# EAGLE design FPV-Auto (EAGLE 7.7.0)

## Sheet 1 of 2
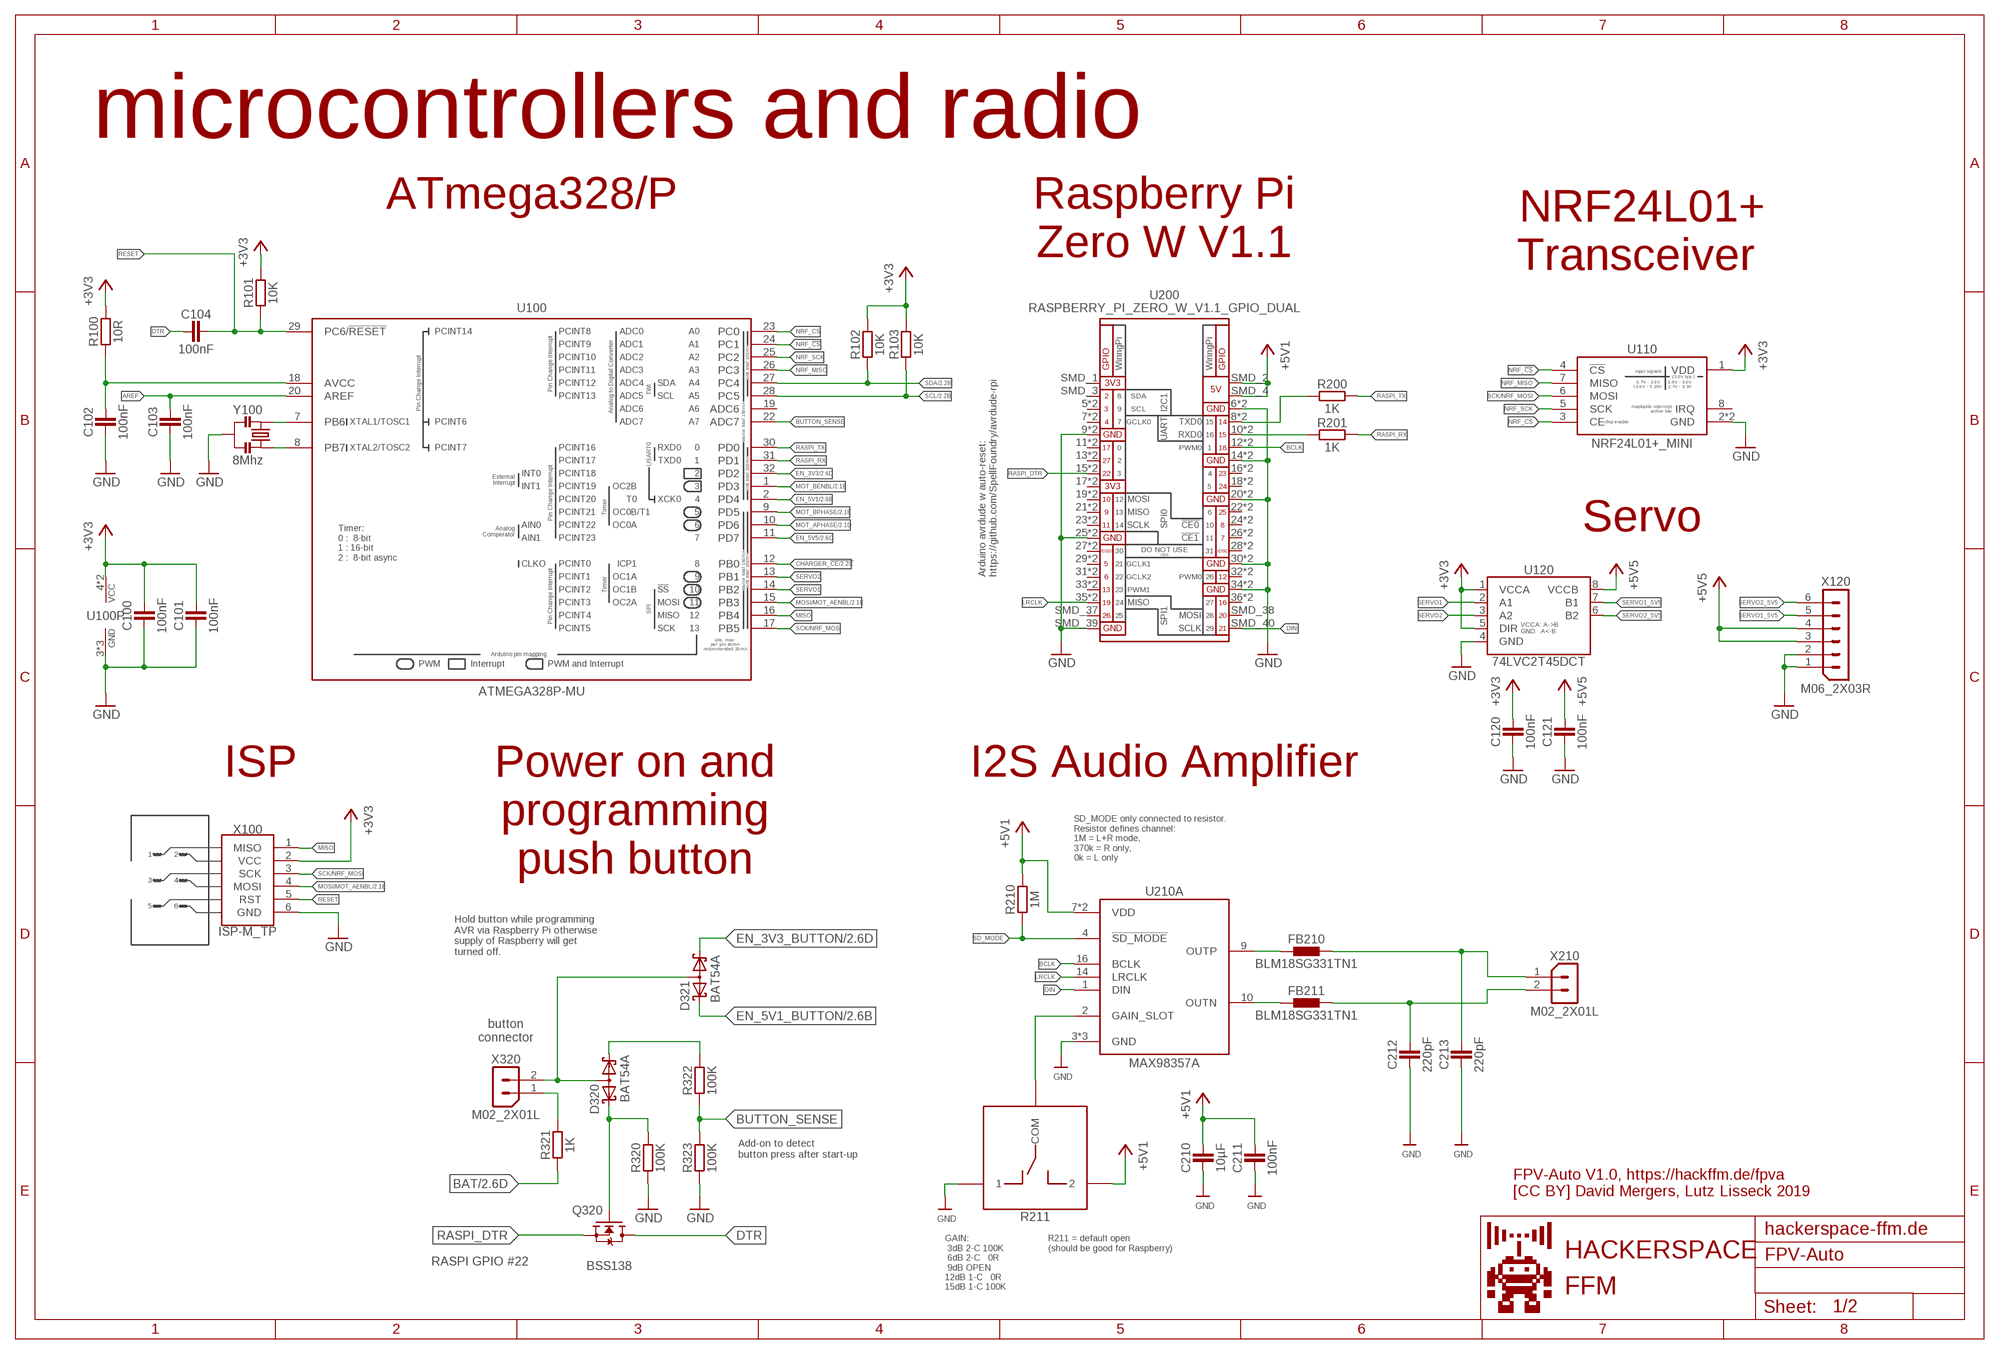
[diagram p0: schematic, sheet 1]

### Parts
C100  100nF  C0603  [C0603]
C101  100nF  C0603  [C0603]
C102  100nF  C0603  [C0603]
C103  100nF  C0603  [C0603]
C104  100nF  C0603  [C0603]
C120  100nF  C0603  [C0603]
C121  100nF  C0603  [C0603]
C210  10µF  C0603  [C0603]
C211  100nF  C0603  [C0603]
C212  220pF  C0603  [C0603]
C213  220pF  C0603  [C0603]
D320  BAT54A  [SOT23]
D321  BAT54A  [SOT23]
FB210  BLM18SG331TN1  [0603]
FB211  BLM18SG331TN1  [0603]
Q320  BSS138  [SOT23-3]
R100  10R  R  [R0603]
R101  10K  R  [R0603]
R102  10K  R  [R0603]
R103  10K  R  [R0603]
R200  1K  R  [R0603]
R201  1K  R  [R0603]
R210  1M  R  [R0603]
R211  R_SWITCH_2_WAY_0603  [R0603_SWITCH_2_WAY]
R320  100K  R  [R0603]
R321  1K  R  [R0603]
R322  100K  R  [R0603]
R323  100K  R  [R0603]
U100  ATMEGA328P-MU  [PBS(S-PQFP-G32)]
U110  NRF24L01+_MINI  [NRF24L01+_MINI]
U120  74LVC2T45DCT  [DCT(R-PDSO-G8)]
U200  RASPBERRY_PI_ZERO_W_V1.1_GPIO_DUAL  [RASPBERRY_PI_ZERO_W_V1.1_GPIO_DUAL]
U210  MAX98357A  [90-0031]
X100  ISP-M_TP  [ISP-M_TP]
X120  M06_2X03R  [M2X03R]
X210  M02_2X01L  [M2X01L]
X320  M02_2X01L  [M2X01L]
Y100  8Mhz  CSTNE8M00GH5C000R0  [CSTNE]

### Nets
+3V3: C100.1 C101.1 C120.1 R100.2 R101.2 R102.2 R103.2 U100.4(VCC) U100.6(VCC) U110.1(VDD) U120.1(VCCA) U120.5(DIR) X100.2(VCC) ; also sheet 2
+5V1: C210.1 C211.1 R210.2 R211.2 U200.SMD_2(5V) U200.SMD_4(5V) U210.7(A:VDD) U210.8(A:VDD) ; also sheet 2
+5V5: C121.1 U120.8(VCCB) X120.3 X120.4 ; also sheet 2
AREF: C103.1 U100.20(AREF)
BAT: R321.2 ; also sheet 2
BCLK: U200.12(GPIO18) U200.SMD_12(GPIO18) U210.16(A:BCLK)
BUTTON_SENSE: R322.1 R323.2 U100.22(ADC7)
CHARGER_!CE: U100.12(PB0) ; also sheet 2
DIN: U200.SMD_40(GPIO21) U210.1(A:DIN)
DTR: C104.2 Q320.3(D)
EN_3V3: U100.32(PD2) ; also sheet 2
EN_3V3_BUTTON: D321.1(K1) ; also sheet 2
EN_5V1: U100.2(PD4) ; also sheet 2
EN_5V1_BUTTON: D321.2(K2) ; also sheet 2
EN_5V5: U100.11(PD7) ; also sheet 2
GAIN: R211.COM U210.2(A:GAIN_SLOT)
GND: C100.2 C101.2 C102.2 C103.2 C120.2 C121.2 C210.2 C211.2 C212.2 C213.2 R211.1 R320.1 R323.1 U100.3(GND) U100.5(GND) U100.21(GND) U110.2(GND) U110.9(GND) U120.4(GND) U200.6(GND) U200.9(GND) U200.14(GND) U200.20(GND) U200.25(GND) U200.30(GND) U200.34(GND) U200.SMD_6(GND) U200.SMD_9(GND) U200.SMD_14(GND) U200.SMD_20(GND) U200.SMD_25(GND) U200.SMD_30(GND) U200.SMD_34(GND) U200.SMD_39(GND) U210.3(A:GND) U210.11(A:GND) U210.15(A:GND) X100.6(GND) X120.1 X120.2 Y100.2 ; also sheet 2
LRCLK: U200.35(GPIO19) U200.SMD_35(GPIO19) U210.14(A:LRCLK)
MISO: U100.16(PB4) X100.1(MISO)
MOSI/MOT_AENBL: U100.15(PB3) X100.4(MOSI) ; also sheet 2
MOT_APHASE: U100.10(PD6) ; also sheet 2
MOT_BENBL: U100.1(PD3) ; also sheet 2
MOT_BPHASE: U100.9(PD5) ; also sheet 2
N$2: D320.3(AA) D321.3(AA) X320.2
N$6: FB211.1 U210.10(A:OUTN)
N$7: FB210.1 U210.9(A:OUTP)
N$8: U100.8(PB7) Y100.3
N$9: U100.7(PB6) Y100.1
N$15: D320.2(K2) R322.2
N$18: D320.1(K1) Q320.1(G) R320.2
N$22: R321.1 X320.1
N$25: C102.1 R100.1 U100.18(AVCC)
N$26: R200.1 U200.8(GPIO14/TXD0) U200.SMD_8(GPIO14/TXD0)
N$27: R201.1 U200.10(GPIO15/RXD0) U200.SMD_10(GPIO15/RXD0)
NRF_!CS: U100.24(PC1) U110.4(!CS)
NRF_CS: U100.23(PC0) U110.3(CE)
NRF_MISO: U100.26(PC3) U110.7(MISO)
NRF_SCK: U100.25(PC2) U110.5(SCK)
RASPI_DTR: Q320.2(S) U200.15(GPIO22/GEN3) U200.SMD_15(GPIO22/GEN3)
RASPI_RX: R201.2 U100.31(PD1)
RASPI_TX: R200.2 U100.30(PD0)
RESET: C104.1 R101.1 U100.29(PC6/!RESET!) X100.5(RST)
SCK/NRF_MOSI: U100.17(PB5) U110.6(MOSI) X100.3(SCK)
SCL: R103.1 U100.28(PC5) ; also sheet 2
SD_MODE: R210.1 U210.4(A:!SD_MODE)
SDA: R102.1 U100.27(PC4) ; also sheet 2
SERVO1: U100.14(PB2) U120.2(A1)
SERVO1_5V5: U120.7(B1) X120.5
SERVO2: U100.13(PB1) U120.3(A2)
SERVO2_5V5: U120.6(B2) X120.6
VO+: C213.1 FB210.2 X210.1
VO-: C212.1 FB211.2 X210.2
Unconnected: U100.19(ADC6) U110.8(IRQ) U200.5(GPIO3/SCL1) U200.7(GPIO4/GCKL) U200.11(GPIO17/GEN0) U200.13(GPIO27/GEN2) U200.16(GPIO23/GEN4) U200.17(3V3) U200.18(GPIO24/GEN5) U200.19(GPIO10/MOSI) U200.21(GPIO9/MISO) U200.22(GPIO25/GEN6) U200.23(GPIO11/SCLK) U200.24(GPIO8/!CE0!) U200.26(GPIO7/!CE1!) U200.27(ID_SD) U200.28(ID_SC) U200.29(GPIO5) U200.31(GPIO6) U200.32(GPIO12) U200.33(GPIO13) U200.36(GPIO16) U200.SMD_1(3V3) U200.SMD_3(GPIO2/SDA1) U200.SMD_5(GPIO3/SCL1) U200.SMD_7(GPIO4/GCKL) U200.SMD_11(GPIO17/GEN0) U200.SMD_13(GPIO27/GEN2) U200.SMD_16(GPIO23/GEN4) U200.SMD_17(3V3) U200.SMD_18(GPIO24/GEN5) U200.SMD_19(GPIO10/MOSI) U200.SMD_21(GPIO9/MISO) U200.SMD_22(GPIO25/GEN6) U200.SMD_23(GPIO11/SCLK) U200.SMD_24(GPIO8/!CE0!) U200.SMD_26(GPIO7/!CE1!) U200.SMD_27(ID_SD) U200.SMD_28(ID_SC) U200.SMD_29(GPIO5) U200.SMD_31(GPIO6) U200.SMD_32(GPIO12) U200.SMD_33(GPIO13) U200.SMD_36(GPIO16) U200.SMD_37(GPIO26) U200.SMD_38(GPIO20)

### Notes on the sheet
- microcontrollers and radio
- ATmega328/P
- Raspberry Pi
  Zero W V1.1
- NRF24L01+
  Transceiver
- Servo
- Arduino avrdude w auto-reset:
  https://github.com/SpellFoundry/avrdude-rpi
- ISP
- Power on and
  programming
  push button
- I2S Audio Amplifier
- SD_MODE only connected to resistor. 
  Resistor defines channel: 
  1M = L+R mode, 
  370k = R only, 
  0k = L only
- Hold button while programming
  AVR via Raspberry Pi otherwise
  supply of Raspberry will get
  turned off.
- button
  connector
- Add-on to detect 
  button press after start-up
- FPV-Auto V1.0, https://hackffm.de/fpva
  [CC BY] David Mergers, Lutz Lisseck 2019
- GAIN:
   3dB 2-C 100K
   6dB 2-C   0R
   9dB OPEN
  12dB 1-C   0R
  15dB 1-C 100K
- R211 = default open 
  (should be good for Raspberry)
- RASPI GPIO #22

## Sheet 2 of 2
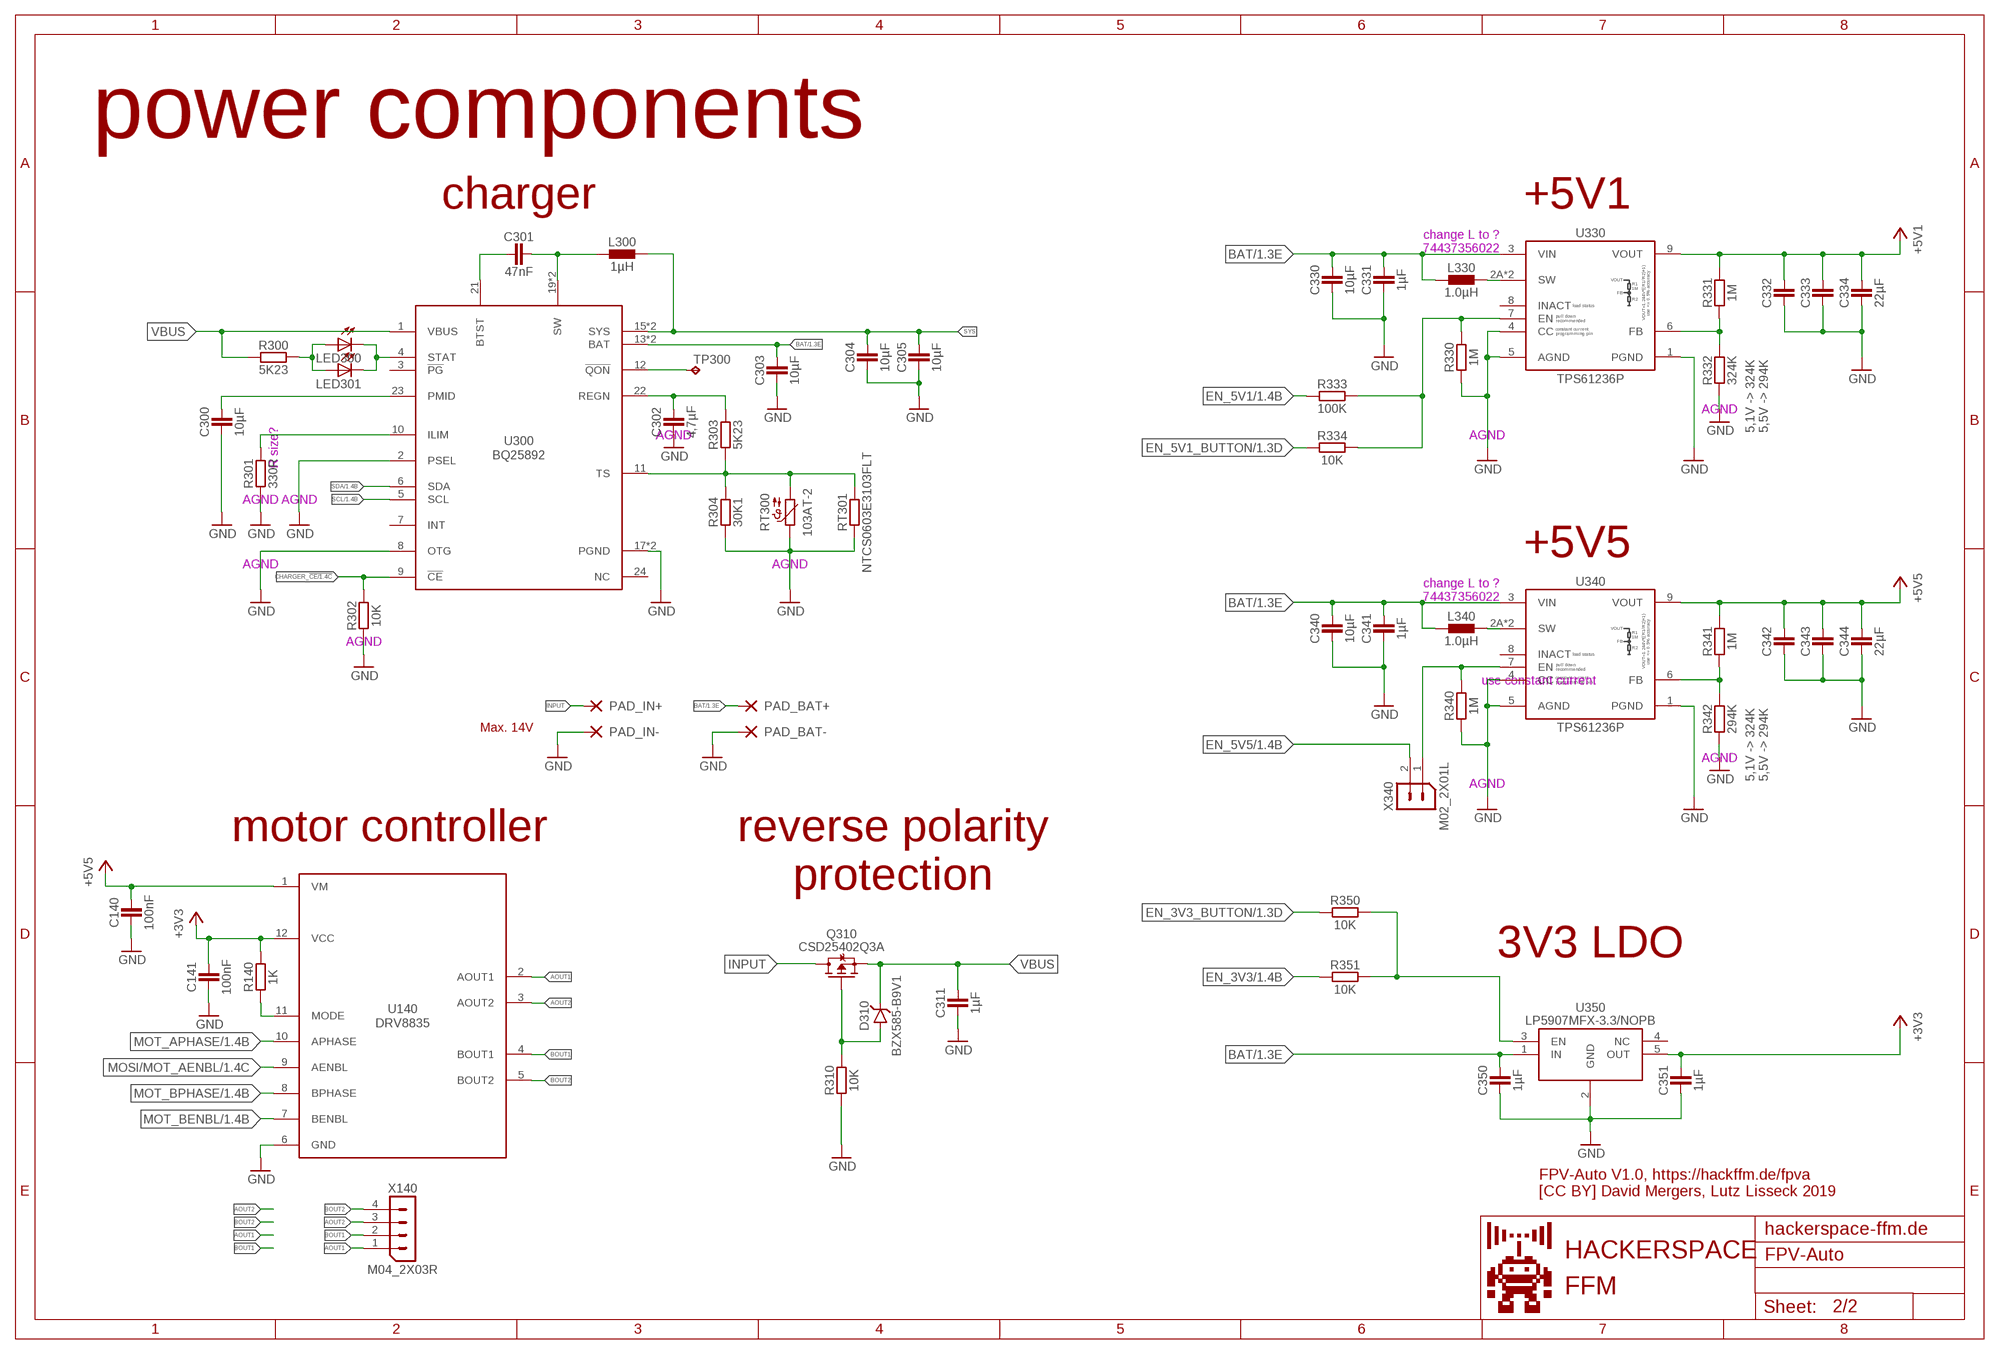
[diagram p1: schematic, sheet 2]

### Parts
C140  100nF  C0603  [C0603]
C141  100nF  C0603  [C0603]
C300  10µF  C0805  [C0805]
C301  47nF  C0402  [C0402]
C302  4,7µF  C0603  [C0603]
C303  10µF  C0805  [C0805]
C304  10µF  C0805  [C0805]
C305  10µF  C0805  [C0805]
C311  1µF  C0805  [C0805]
C330  10µF  C0603  [C0603]
C331  1µF  C0603  [C0603]
C332  22µF  C0805  [C0805]
C333  22µF  C0805  [C0805]
C334  22µF  C0805  [C0805]
C340  10µF  C0603  [C0603]
C341  1µF  C0603  [C0603]
C342  22µF  C0805  [C0805]
C343  22µF  C0805  [C0805]
C344  22µF  C0805  [C0805]
C350  1µF  C0603  [C0603]
C351  1µF  C0603  [C0603]
D310  BZX585-B9V1  [SOD523(SC-79)]
L300  1µH  78438357010  [4030]
L330  1.0µH  XAL7030-102ME  [XAL7030]
L340  1.0µH  XAL7030-102ME  [XAL7030]
LED300  LEDCHIP-LED0603  [CHIP-LED0603]
LED301  LED3MM  [LED3MM]
PAD_BAT+  WIREPAD2,15/1,0  [2,15/1,0]
PAD_BAT-  WIREPAD2,15/1,0  [2,15/1,0]
PAD_IN+  WIREPAD2,15/1,0  [2,15/1,0]
PAD_IN-  WIREPAD2,15/1,0  [2,15/1,0]
Q310  CSD25402Q3A  [Q3A]
R140  1K  R  [R0603]
R300  5K23  R  [R0603]
R301  330R  R  [R0603]
R302  10K  R  [R0603]
R303  5K23  R  [R0603]
R304  30K1  R  [R0603]
R310  10K  R  [R0603]
R330  1M  R  [R0603]
R331  1M  R  [R0603]
R332  324K  R  [R0603]
R333  100K  R  [R0603]
R334  10K  R  [R0603]
R340  1M  R  [R0603]
R341  1M  R  [R0603]
R342  294K  R  [R0603]
R350  10K  R  [R0603]
R351  10K  R  [R0603]
RT300  103AT-2  [AT-2]
RT301  NTCS0603E3103FLT  R  [R0603]
TP300  TPB1,27  [B1,27]
U140  DRV8835  [DSS(WSON-12)]
U300  BQ25892  [RTW(S-PWQFN-N24)_LONG]
U330  TPS61236P  [RWL(S-PQFP-N9)_LONG]
U340  TPS61236P  [RWL(S-PQFP-N9)_LONG]
U350  LP5907MFX-3.3/NOPB  [DBV(R-PDSO-G5)]
X140  M04_2X03R  [M2X02R]
X340  M02_2X01L  [M2X01L]

### Nets
+3V3: C141.1 C351.1 R140.1 U140.12(VCC) U350.5(OUT) ; also sheet 1
+5V1: C332.1 C333.1 C334.1 R331.2 U330.9(VOUT) ; also sheet 1
+5V5: C140.1 C342.1 C343.1 C344.1 R341.2 U140.1(VM) U340.9(VOUT) ; also sheet 1
AOUT1: U140.2(AOUT1) X140.1
AOUT2: U140.3(AOUT2) X140.3
BAT: C303.1 C330.1 C331.1 C340.1 C341.1 C350.1 L330.1 L340.1 PAD_BAT+.1(P) U300.13(BAT) U300.14(BAT) U330.3(VIN) U340.3(VIN) U350.1(IN) ; also sheet 1
BOUT1: U140.4(BOUT1) X140.2
BOUT2: U140.5(BOUT2) X140.4
CHARGER_!CE: R302.2 U300.9(!CE) ; also sheet 1
EN_3V3: R351.1 ; also sheet 1
EN_3V3_BUTTON: R350.1 ; also sheet 1
EN_3V3_JMP: R350.2 R351.2 U350.3(EN)
EN_5V1: R333.1 ; also sheet 1
EN_5V1_BUTTON: R334.1 ; also sheet 1
EN_5V1_JMP: R330.2 R333.2 R334.2 U330.7(EN)
EN_5V5: X340.2 ; also sheet 1
EN_5V5_JMP: R340.2 U340.7(EN) X340.1
GND: C140.2 C141.2 C300.2 C302.2 C303.2 C304.2 C305.2 C311.2 C330.2 C331.2 C332.2 C333.2 C334.2 C340.2 C341.2 C342.2 C343.2 C344.2 C350.2 C351.2 PAD_BAT-.1(P) PAD_IN-.1(P) R301.1 R302.1 R304.1 R310.1 R330.1 R332.1 R340.1 R342.1 RT300.P$1 RT301.1 U140.6(GND) U300.2(PSEL) U300.8(OTG) U300.17(PGND) U300.18(PGND) U330.1(PGND) U330.4(CC) U330.5(AGND) U340.1(PGND) U340.4(CC) U340.5(AGND) U350.2(GND) ; also sheet 1
INPUT: PAD_IN+.1(P) Q310.1(D) Q310.2(D) Q310.3(D)
MOSI/MOT_AENBL: U140.9(AENBL) ; also sheet 1
MOT_APHASE: U140.10(APHASE) ; also sheet 1
MOT_BENBL: U140.7(BENBL) ; also sheet 1
MOT_BPHASE: U140.8(BPHASE) ; also sheet 1
N$1: L330.2 U330.2A(SW) U330.2B(SW)
N$3: L340.2 U340.2A(SW) U340.2B(SW)
N$4: R341.1 R342.2 U340.6(FB)
N$5: R331.1 R332.2 U330.6(FB)
N$10: TP300.TP U300.12(!QON)
N$11: R303.1 R304.2 RT300.P$2 RT301.2 U300.11(TS)
N$12: C302.1 R303.2 U300.22(REGN)
N$13: R301.2 U300.10(ILIM)
N$14: C301.2 U300.21(BTST)
N$15_SW: C301.1 L300.P$1 U300.19(SW) U300.20(SW)
N$16: D310.A Q310.4(G) R310.2
N$17: C300.1 U300.23(PMID)
N$19: LED300.C LED301.K(C) U300.4(STAT)
N$20: LED300.A LED301.A R300.1
N$24: R140.2 U140.11(MODE)
SCL: U300.5(SCL) ; also sheet 1
SDA: U300.6(SDA) ; also sheet 1
SYS: C304.1 C305.1 L300.P$2 U300.15(SYS) U300.16(SYS)
VBUS: C311.1 D310.C Q310.TP0(S) Q310.TP1(S) Q310.TP2(S) Q310.TP3(S) Q310.TP4(S) Q310.TP5(S) Q310.TP6(S) Q310.TP7(S) R300.2 U300.1(VBUS)
Unconnected: U300.3(!PG) U300.7(INT) U300.24(NC) U330.8(INACT) U340.8(INACT) U350.4(NC)

### Notes on the sheet
- power components
- charger | +5V1
- change L to ?
  74437356022
- 5,1V -> 324K
  5,5V -> 294K
- AGND
- AGND | AGND
- R size?
- AGND | AGND
- +5V5
- AGND | AGND
- change L to ?
  74437356022
- AGND
- use constant current
- Max. 14V
- 5,1V -> 324K
  5,5V -> 294K
- AGND
- AGND
- motor controller
- reverse polarity
  protection
- 3V3 LDO
- FPV-Auto V1.0, https://hackffm.de/fpva
  [CC BY] David Mergers, Lutz Lisseck 2019

## Power pins joined to a net without a drawn wire
GND: U140.TP1(GND) U140.TP2(GND) U140.TP3(GND) U140.TP(GND) U210.TP0(T:GND) U210.TP1(T:GND) U300.TP0(GND) U300.TP1(GND) U300.TP2(GND) U300.TP3(GND) U300.TP4(GND) U300.TP5(GND) U300.TP6(GND) U300.TP7(GND) U300.TP8(GND) U300.TP9(GND)

## Library data of the parts
C100-C104 C120 C121 C140 C141 C210-C213 C300-C305 C311 C330-C334 C340-C344 C350 C351 = FPV-Auto:C
D310 = FPV-Auto:BZX585: BZX585-XXX Voltage regulator diodes Low-power voltage regulator diodes encapsulated in an ultra small SOD523 plastic SMD package. The diodes are available in the normalized E24 +- 2 pct (BZX585-B) and +- 5 pct (BZX585-C) tolerance range. The series consists of 37 types with nominal working voltages from 2.4 V to 75 V. Links Datasheet <https://assets.nexperia.com/documents/data-sheet/BZX585_SERIES.pdf> Product website <https://www.nexperia.com/products/diodes/zener-diodes/BZX585-C5V1.html>; CODE: E5; WORK_V_MAX: 9.28; WORK_V_MIN: 8.92
D320 D321 = diode:BAT54A: Schottky Diodes Source: Fairchild .. BAT54.pdf
FB210 FB211 = FPV-Auto:BLM18S: BLM18S Power Lines Type Chip Ferrite Bead Links Datasheet <https://www.murata.com/~/media/webrenewal/support/library/catalog/products/emc/emifil/c31e.ashx?la=en-gb> Product website <https://www.murata.com/en-eu/products/emc/emifil/bl>; I: 1.5; R100MHZ: 330; RDC: 0.070
L300 = FPV-Auto:78438357010: 78438357010 WE-MAIA SMT Speicherdrossel Links Datasheet <http://katalog.we-online.de/pbs/datasheet/78438321010.pdf> Product website <http://katalog.we-online.de/de/pbs/WE-MAIA/78438323082>
L330 L340 = FPV-Auto:XAL7030: XAL7030 XAL7030 Series High Current Shielded Power Inductors Links Datasheet <https://www.coilcraft.com/pdfs/xal7030.pdf> Product website <https://www.coilcraft.com/xal7030.cfm>; OC_MOUSER: 994-XAL7030-102ME; TOL: 20%
LED300 LED301 = led:LED: LED OSRAM: - CHIPLED LG R971, LG N971, LY N971, LG Q971, LY Q971, LO R971, LY R971 LH N974, LH R974 LS Q976, LO Q976, LY Q976 LO Q996 - Hyper CHIPLED LW Q18S LB Q993, LB Q99A, LB R99A - SideLED LS A670, LO A670, LY A670, LG A670, LP A670 LB A673, LV A673, LT A673, LW A673 LH A674 LY A675 LS A676, LA A676, LO A676, LY A676, LW A676 LS A679, LY A679, LG A679 - Hyper Micro SIDELED® LS Y876, LA Y876, LO Y876, LY Y876 LT Y87S - SmartLED LW L88C, LW L88S LB L89C, LB L89S, LG L890 LS L89K, LO L89K, LY L89K LS L896, LA L896, LO L896, LY L896 - TOPLED LS T670, LO T670, LY T670, LG T670, LP T670 LSG T670, LSP T670, LSY T670, LOP T670, LYG T670 LG T671, LOG T671, LSG T671 LB T673, LV T673, LT T673, LW T673 LH T674 LS T676, LA T676, LO T676, LY T676, LB T676, LH T676, LSB T676, LW T676 LB T67C, LV T67C, LT T67C, LS T67K, LO T67K, LY T67K, LW E67C LS E67B, LA E67B, LO E67B, LY E67B, LB E67C, LV E67C, LT E67C LW T67C LS T679, LY T679, LG T679 LS T770, LO T770, LY T770, LG T770, LP T770 LB T773, LV T773, LT T773, LW T773 LH T774 LS E675, LA E675, LY E675, LS T675 LS T776, LA T776, LO T776, LY T776, LB T776 LHGB T686 LT T68C, LB T68C - Hyper Mini TOPLED® LB M676 - Mini TOPLED Santana® LG M470 LS M47K, LO M47K, LY M47K Source: http://www.osram.convergy.de LUXEON: - LUMILED® LXK2-PW12-R00, LXK2-PW12-S00, LXK2-PW14-U00, LXK2-PW14-V00 LXK2-PM12-R00, LXK2-PM12-S00, LXK2-PM14-U00 LXK2-PE12-Q00, LXK2-PE12-R00, LXK2-PE12-S00, LXK2-PE14-T00, LXK2-PE14-U00 LXK2-PB12-K00, LXK2-PB12-L00, LXK2-PB12-M00, LXK2-PB14-N00, LXK2-PB14-P00, LXK2-PB14-Q00 LXK2-PR12-L00, LXK2-PR12-M00, LXK2-PR14-Q00, LXK2-PR14-R00 LXK2-PD12-Q00, LXK2-PD12-R00, LXK2-PD12-S00 LXK2-PH12-R00, LXK2-PH12-S00 LXK2-PL12-P00, LXK2-PL12-Q00, LXK2-PL12-R00 Source: www.luxeon.com KINGBRIGHT: KA-3528ASYC Source: www.kingbright.com
PAD_BAT+ PAD_BAT- PAD_IN+ PAD_IN- = wirepad:WIREPAD: Wire PAD connect wire on PCB
Q310 = FPV-Auto:CSD25402Q3A: CSD25402Q3A P-Channel NexFET Power MOSFET Links Datasheet <http://www.ti.com/lit/gpn/csd25402q3a> Product website <http://www.ti.com/product/CSD25402Q3A>
Q320 = FPV-Auto:BSS138: BSS138 N-Channel Logic Level Enhancement Mode Field Effect Transistor, 50V, 220mA Links Datasheet <https://www.onsemi.com/pub/Collateral/BSS138-D.PDF> Product website <https://www.onsemi.com/PowerSolutions/product.do?id=BSS138>
R100-R103 R140 R200 R201 R210 R300-R304 R310 R320-R323 R330-R334 R340-R342 R350 R351 RT301 = FPV-Auto:R
R211 = FPV-Auto:R_SWITCH_2_WAY
RT300 = FPV-Auto:103AT-2: AT-2 AT Thermistor Series (high accuracy type) Links Datasheet <http://www.atcsemitec.co.uk/pdfdocs/AT-2-thermistors.pdf> Product website <http://www.atcsemitec.co.uk/at-thermistors.html>
TP300 = testpad:TP: Test pad
U100 = FPV-Auto:ATMEGA328P: ATmega328P 8-Bit Mikrocontroller - MCU 32KB In-system Flash 20MHz 1.8V-5.5V Links Datasheet <http://ww1.microchip.com/downloads/en/DeviceDoc/ATmega48A-PA-88A-PA-168A-PA-328-P-DS-DS40002061A.pdf> Product website <https://www.microchip.com/wwwproducts/en/ATmega328p>; OC_MOUSER: 556-ATMEGA328P-AU
U110 = FPV-Auto:NRF24L01+: nRF24L01+ Single Chip 2.4GHz Transceiver Links Datasheet <https://www.nordicsemi.com/eng/nordic/download_resource/8765/2/78942384/2726> Product website <https://www.nordicsemi.com/eng/Products/2.4GHz-RF/nRF24L01P/(language)/eng-GB>
U120 = FPV-Auto:74*2T45: SN74LVC2T45 ual-Bit Dual-Supply Bus Transceiver With Configurable Voltage Translation Links Datasheet <http://www.ti.com/lit/gpn/sn74lvc2t45> Product website <http://www.ti.com/product/SN74LVC2T45>
U140 = FPV-Auto:DRV8835: DRV8835 DRV8835 Dual Low-Voltage H-Bridge IC Links Datasheet <http://www.ti.com/lit/gpn/drv8835> Product website <http://www.ti.com/product/DRV8835>
U200 = FPV-Auto:RASPBERRY_PI_ZERO_W_V1.1_GPIO: Raspberry Pi Zero W The Raspberry Pi Zero W extends the Pi Zero family and comes with added wireless LAN and Bluetooth connectivity. Links GPIO Pinout guide <https://pinout.xyz/> Product website <https://www.raspberrypi.org/products/raspberry-pi-zero-w/> Connectors needed: Power & SD: 0906-4-15-20-75-14-11-0 USB data: 0985-0-15-20-71-14-11-0 GPIO: BL 1X20G 2,54 (Reichelt) GPIO SMD: 855-M20-7812045 (Mouser)
U210 = FPV-Auto:MAX98357A: PART_NAME SHORT_DESCRIPTION Links Datasheet <https://datasheets.maximintegrated.com/en/ds/MAX98357A-MAX98357B.pdf> Product website <https://www.maximintegrated.com/en/products/analog/audio/MAX98357A.html>
U300 = FPV-Auto:BQ25892: BQ25892 bq25892 I2C Controlled Single Cell 5-A Fast Charger with MaxChargeTM Technology for High Input Voltage and Adjustable Voltage USB On-the-Go Boost Mode datasheet (Rev. C) Links Datasheet <https://www.ti.com/lit/gpn/bq25892> Product website <https://www.ti.com/product/BQ25892>
U330 U340 = FPV-Auto:TPS61236P: TPS61236P TPS6123x 8-A Valley Current Synchronous Boost Converters with Constant Current Output Feature datasheet (Rev. A) Links Datasheet <http://www.ti.com/lit/ds/symlink/tps61236p.pdf> Product website <http://www.ti.com/product/TPS61236P>
U350 = FPV-Auto:LP5907MFX-3.3/NOPB: LP5907 The LP5907 is a low-noise LDO that can supply up to 250 mA output current. Designed to meet the requirements of RF and analog circuits, the LP5907 device provides low noise, high PSRR, low quiescent current, and low line or load transient response figures. Using new innovative design techniques, the LP5907 offers class-leading noise performance without a noise bypass capacitor and the ability for remote output capacitor placement. The device is designed to work with a 1-µF input and a 1-µF output ceramic capacitor (no separate noise bypass capacitor is required). Links Datasheet <http://www.ti.com/lit/ds/symlink/lp5907.pdf> Product website <http://www.ti.com/product/LP5907>
X100 = FPV-Auto:ISP-M
X120 = FPV-Auto:M06
X140 = FPV-Auto:M04
X210 X320 X340 = FPV-Auto:M02
Y100 = FPV-Auto:CSTNE: CSTNE Ceramic Resonator Built in Capacitor Links Part Numbering <https://www.murata.com/en-us/products/productdata/8796821913630/L0430E.pdf> Datasheet <https://www.murata.com/en-global/products/productdata/8801161773086/SPEC-CSTNE8M00GH5C000R0.pdf?1519875007000> Product website <HTTPS_LINK>; LOAD_CAPACITY: 33pF; OC_MOUSER: 81-CSTNE8M00GH5C000R

## Board
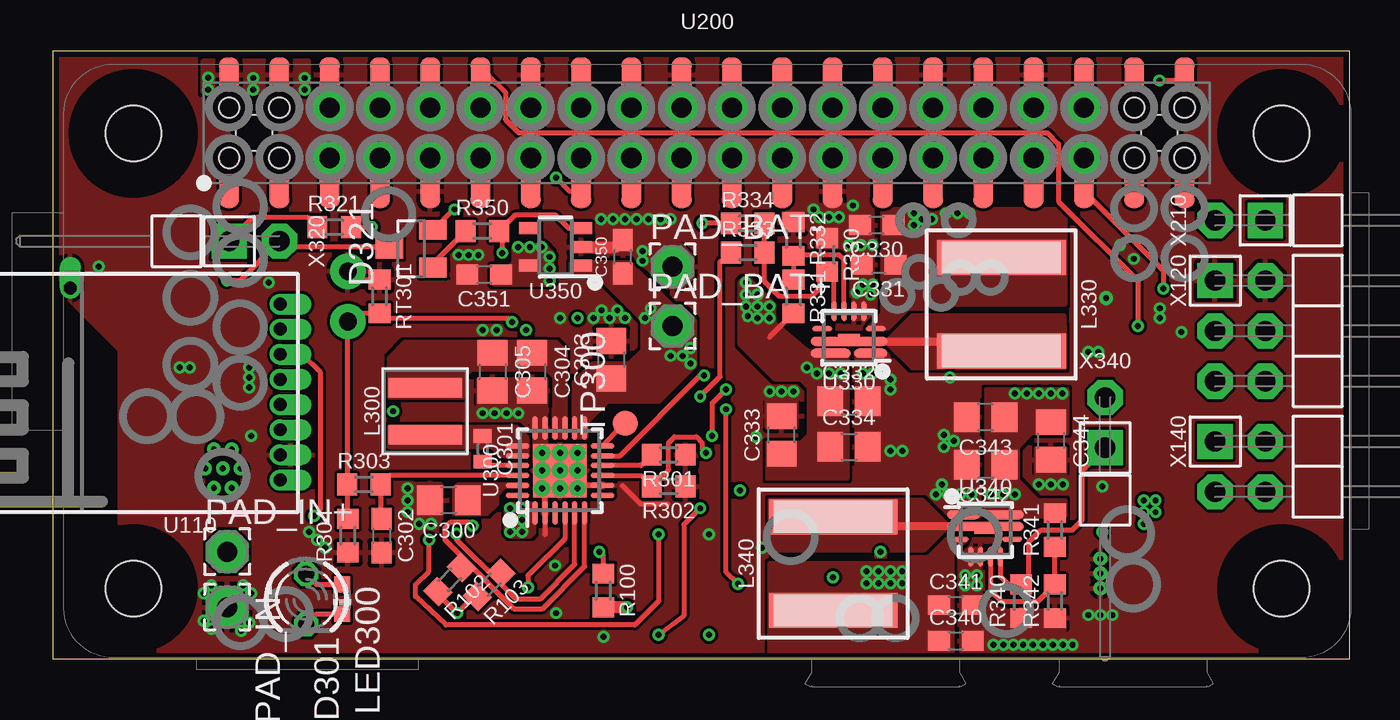
[diagram p2: board, top side]
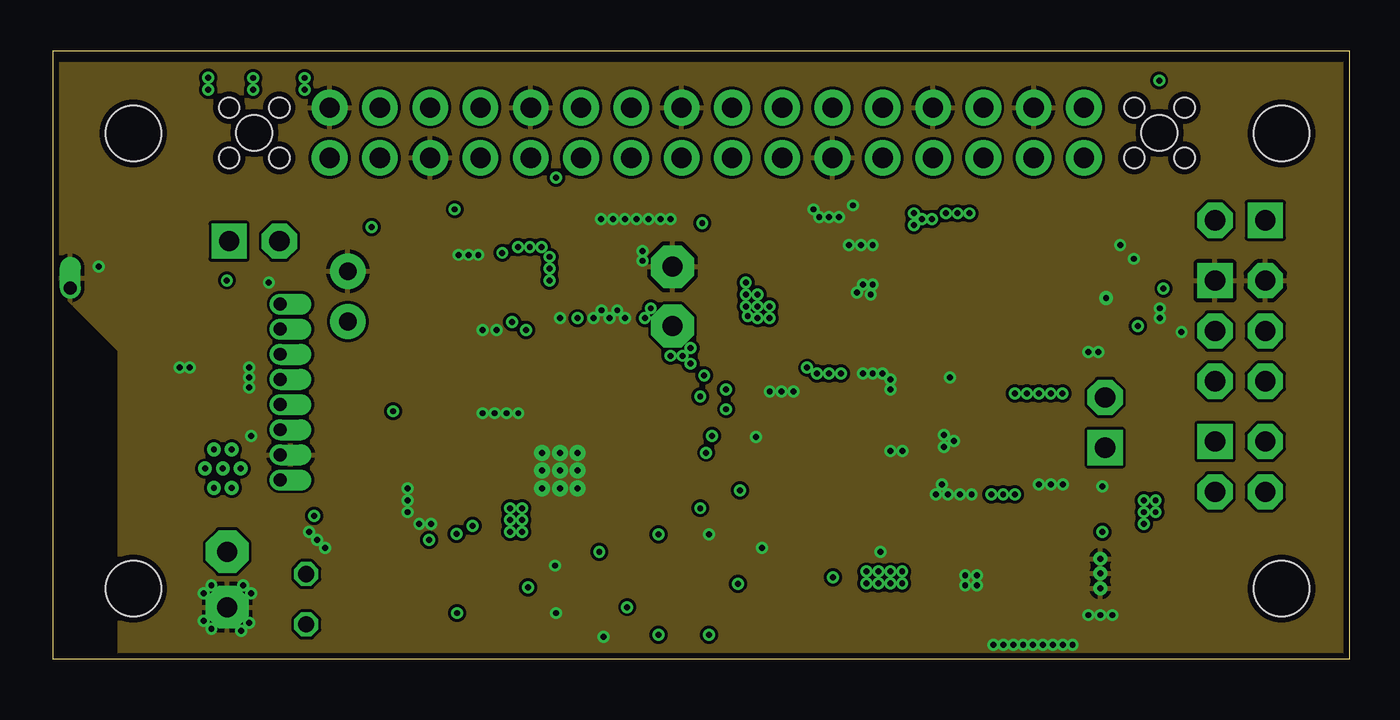
[diagram p3: board, inner layer GND]
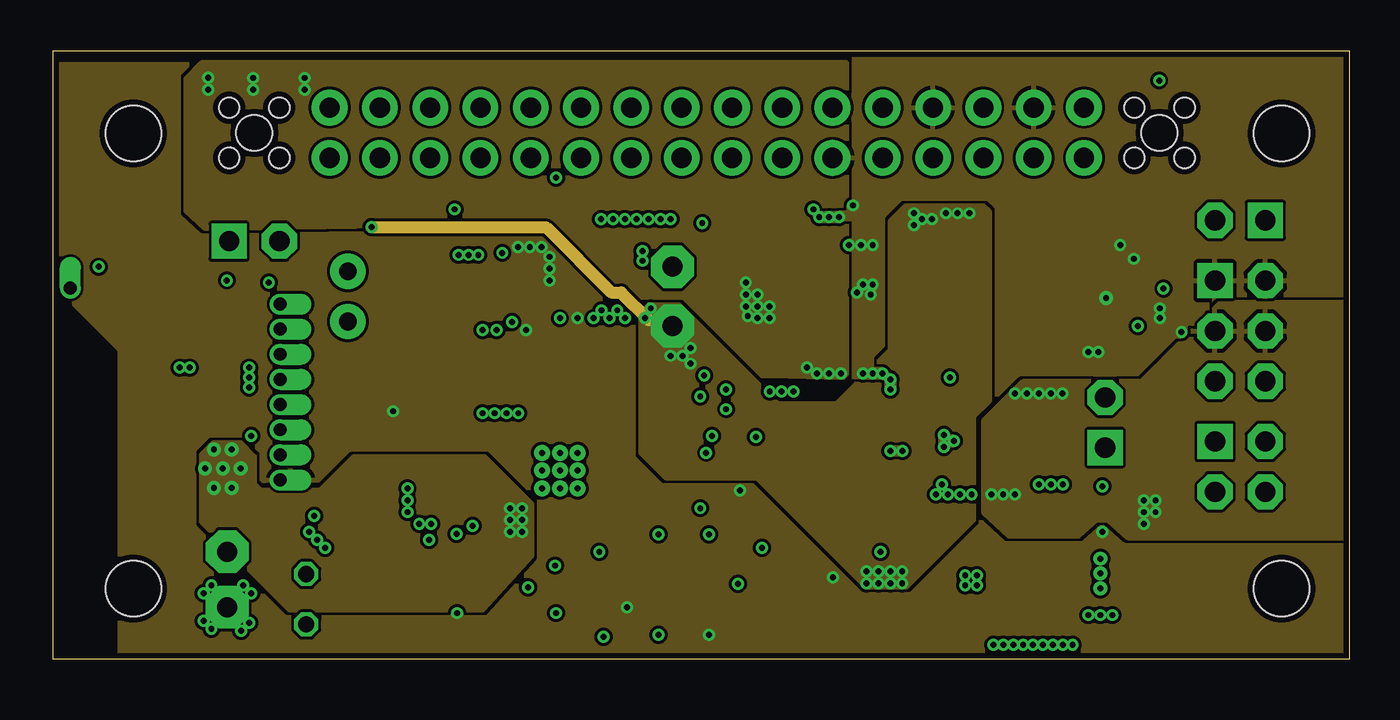
[diagram p4: board, inner layer Route15]
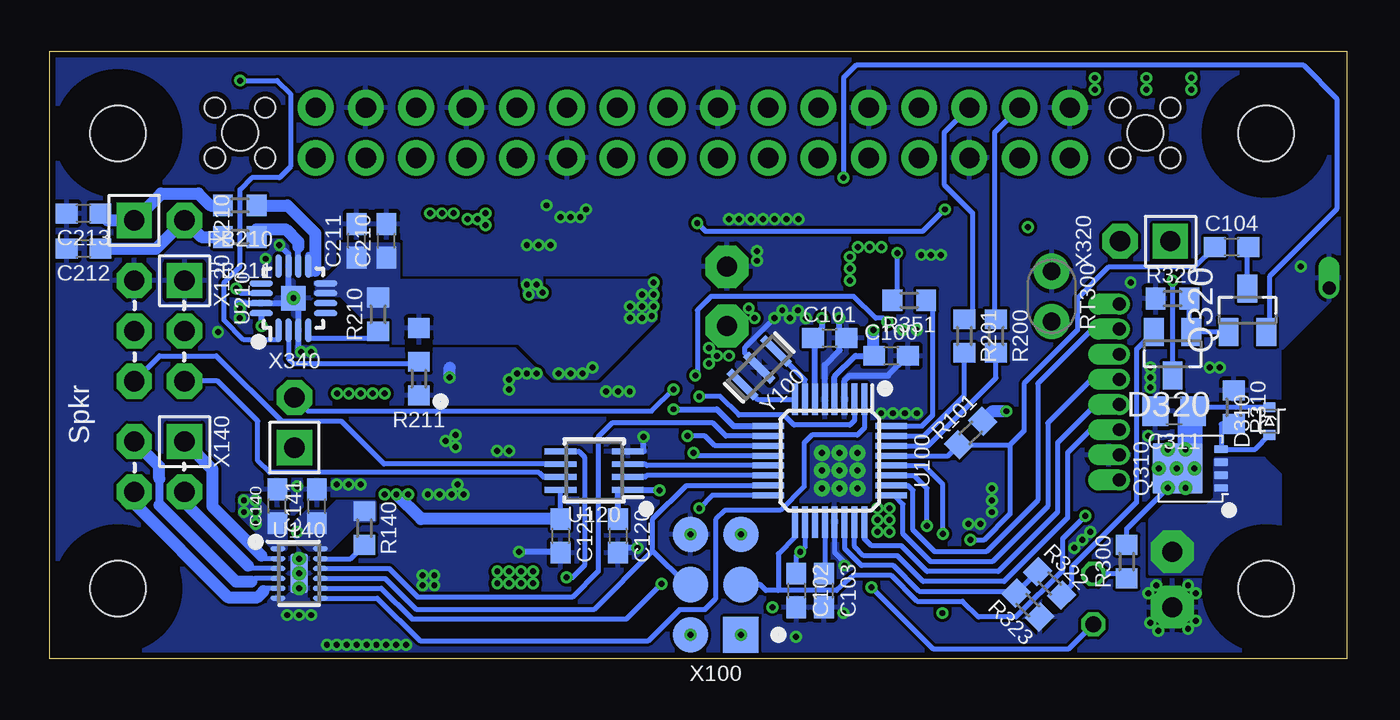
[diagram p5: board, bottom side, seen from below]

Size 65.52 x 30.68 mm. Coordinates in mm from the lower left corner, seen from the top.
Outline: 0,0 65.52,0 65.52,30.68 0,30.68 0,0
Copper layers (1+2*15+16): Top 0.035mm / dielectric 0.38mm / GND 0.035mm / dielectric 0.71mm / Route15 0.035mm / dielectric 0.38mm / Bottom 0.035mm
Design rules "PCB-POOL Standard_ML4 *": minimum track width 0.15mm, minimum drill 0.3mm, track to track 0.15mm, track to pad 0.15mm, pad to pad 0.15mm, via to via 0.15mm, smd to smd 0.15mm, copper to edge 0.3mm, drill to drill 0.2mm, minimum pad ring 0.2mm, minimum via ring 0.15mm, stop-mask expansion 0.075mm, vias tented up to drill 0.3mm, thermal gap 0.2mm

### Footprints (pad centres in the part's own frame; a part is rotated, then mirrored left to right if it is on the bottom)
C0603 = smd 1.1 x 1: 1 -0.85,0; 2 0.85,0
C0805 = smd 1.3 x 1.5: 1 -0.95,0; 2 0.95,0
C0402 = smd 0.7 x 0.9: 1 -0.65,0; 2 0.65,0
SOD523(SC-79) = smd 0.5 x 0.6: A -0.7,0; C 0.7,0
SOT23 = smd 1 x 1.4: 1 -0.95,-1.1; 2 0.95,-1.1; 3 0,1.1
0603 = smd 1 x 1.1: 1 -0.85,0; 2 0.85,0
4030 = smd 0.98 x 3.7: P$1 -1.185,0; P$2 1.185,0
XAL7030 = smd 1.78 x 6.5: 1 -2.36,0; 2 2.36,0
CHIP-LED0603 = smd 0.8 x 0.8: A 0,-0.75; C 0,0.75
LED3MM = drill 0.813 octagon: A -1.27,0; K 1.27,0
2,15/1,0 = drill 1.016 pad 2.159 octagon: 1 0,0
Q3A = smd 0.7 x 0.4: 1 -1.55,0.975; 2 -1.55,0.325; 3 -1.55,-0.325; 4 -1.55,-0.975 | smd 2.51 x 2.55: TP0 0.647,0 | drill 0.3: TP1 0.245,0.975; TP2 1.15,0.975; TP3 -0.207,0; TP4 0.698,0; TP5 1.603,0; TP6 0.245,-0.975; TP7 1.15,-0.975
SOT23-3 = smd 1.4 x 1: 1 -1.1,0.95; 2 -1.1,-0.95; 3 1.1,0
R0603 = smd 1 x 1.1: 1 -0.85,0; 2 0.85,0
R0603_SWITCH_2_WAY = smd 1.1 x 1: 1 0,1.7; 2 0,-1.7; COM 0,0
AT-2 = drill 0.9 pad 1.778: P$1 -1.27,0; P$2 1.27,0
B1,27 = smd 1.27 x 1.27: TP 0,0
PBS(S-PQFP-G32) = smd 1.6 x 0.3: 1 -3.1,1.75; 2 -3.1,1.25; 3 -3.1,0.75; 4 -3.1,0.25; 5 -3.1,-0.25; 6 -3.1,-0.75; 7 -3.1,-1.25; 8 -3.1,-1.75; 17 3.1,-1.75; 18 3.1,-1.25; 19 3.1,-0.75; 20 3.1,-0.25; 21 3.1,0.25; 22 3.1,0.75; 23 3.1,1.25; 24 3.1,1.75 | smd 0.3 x 1.6: 9 -1.75,-3.1; 10 -1.25,-3.1; 11 -0.75,-3.1; 12 -0.25,-3.1; 13 0.25,-3.1; 14 0.75,-3.1; 15 1.25,-3.1; 16 1.75,-3.1; 25 1.75,3.1; 26 1.25,3.1; 27 0.75,3.1; 28 0.25,3.1; 29 -0.25,3.1; 30 -0.75,3.1; 31 -1.25,3.1; 32 -1.75,3.1
NRF24L01+_MINI = drill 0.65 pad 1.016 offset: 1 -4.445,-10; 2 -3.175,-10; 3 -1.905,-10; 4 -0.635,-10; 5 0.635,-10; 6 1.905,-10; 7 3.175,-10; 8 4.445,-10; 9 5.245,0.6
DCT(R-PDSO-G8) = smd 1.6 x 0.3: 1 -1.7,0.975; 2 -1.7,0.325; 3 -1.7,-0.325; 4 -1.7,-0.975; 5 1.7,-0.975; 6 1.7,-0.325; 7 1.7,0.325; 8 1.7,0.975
DSS(WSON-12) = smd 0.75 x 0.25: 1 -1.075,1.25; 2 -1.075,0.75; 3 -1.075,0.25; 4 -1.075,-0.25; 5 -1.075,-0.75; 6 -1.075,-1.25; 7 1.075,-1.25; 8 1.075,-0.75; 9 1.075,-0.25; 10 1.075,0.25; 11 1.075,0.75; 12 1.075,1.25 | smd 0.9 x 2: TP 0,0 | drill 0.3: TP1 0,0.75; TP2 0,0; TP3 0,-0.75
RASPBERRY_PI_ZERO_W_V1.1_GPIO_DUAL = drill 1.02 pad 1.8: 5 5.08,0; 6 5.08,2.54; 7 7.62,0; 8 7.62,2.54; 9 10.16,0; 10 10.16,2.54; 11 12.7,0; 12 12.7,2.54; 13 15.24,0; 14 15.24,2.54; 15 17.78,0; 16 17.78,2.54; 17 20.32,0; 18 20.32,2.54; 19 22.86,0; 20 22.86,2.54; 21 25.4,0; 22 25.4,2.54; 23 27.94,0; 24 27.94,2.54; 25 30.48,0; 26 30.48,2.54; 27 33.02,0; 28 33.02,2.54; 29 35.56,0; 30 35.56,2.54; 31 38.1,0; 32 38.1,2.54; 33 40.64,0; 34 40.64,2.54; 35 43.18,0; 36 43.18,2.54 | smd 1.02 x 1.72: SMD_1 0,-1.67; SMD_2 0,4.21; SMD_3 2.54,-1.67; SMD_4 2.54,4.21; SMD_5 5.08,-1.67; SMD_6 5.08,4.21; SMD_7 7.62,-1.67; SMD_8 7.62,4.21; SMD_9 10.16,-1.67; SMD_10 10.16,4.21; SMD_11 12.7,-1.67; SMD_12 12.7,4.21; SMD_13 15.24,-1.67; SMD_14 15.24,4.21; SMD_15 17.78,-1.67; SMD_16 17.78,4.21; SMD_17 20.32,-1.67; SMD_18 20.32,4.21; SMD_19 22.86,-1.67; SMD_20 22.86,4.21; SMD_21 25.4,-1.67; SMD_22 25.4,4.21; SMD_23 27.94,-1.67; SMD_24 27.94,4.21; SMD_25 30.48,-1.67; SMD_26 30.48,4.21; SMD_27 33.02,-1.67; SMD_28 33.02,4.21; SMD_29 35.56,-1.67; SMD_30 35.56,4.21; SMD_31 38.1,-1.67; SMD_32 38.1,4.21; SMD_33 40.64,-1.67; SMD_34 40.64,4.21; SMD_35 43.18,-1.67; SMD_36 43.18,4.21; SMD_37 45.72,-1.67; SMD_38 45.72,4.21; SMD_39 48.26,-1.67; SMD_40 48.26,4.21 | hole 2.8: 53.16,1.24; 53.16,-21.76; -4.84,-21.76; -4.84,1.24 | hole 1.8: 1.27,1.27; 46.99,1.27 | hole 1.02: 0,0; 2.54,0; 2.54,2.54; 0,2.54; 45.72,0; 48.26,0; 48.26,2.54; 45.72,2.54
90-0031 = smd 1.2 x 0.3: 1 -1.625,0.75; 2 -1.625,0.25; 3 -1.625,-0.25; 4 -1.625,-0.75; 9 1.625,-0.75; 10 1.625,-0.25; 11 1.625,0.25; 12 1.625,0.75 | smd 0.3 x 1.2: 5 -0.75,-1.625; 6 -0.25,-1.625; 7 0.25,-1.625; 8 0.75,-1.625; 13 0.75,1.625; 14 0.25,1.625; 15 -0.25,1.625; 16 -0.75,1.625 | smd 1.23 x 1.23: TP0 0,0 | drill 0.3: TP1 0,0
RTW(S-PWQFN-N24)_LONG = smd 1.19 x 0.28: 1 -2.145,1.25; 2 -2.145,0.75; 3 -2.145,0.25; 4 -2.145,-0.25; 5 -2.145,-0.75; 6 -2.145,-1.25; 13 2.145,-1.25; 14 2.145,-0.75; 15 2.145,-0.25; 16 2.145,0.25; 17 2.145,0.75; 18 2.145,1.25 | smd 0.28 x 1.19: 7 -1.25,-2.145; 8 -0.75,-2.145; 9 -0.25,-2.145; 10 0.25,-2.145; 11 0.75,-2.145; 12 1.25,-2.145; 19 1.25,2.145; 20 0.75,2.145; 21 0.25,2.145; 22 -0.25,2.145; 23 -0.75,2.145; 24 -1.25,2.145 | smd 2.7 x 2.7: TP0 0,0 | drill 0.3 pad 0.8: TP1 -0.9,0.9; TP2 -0.9,0; TP3 -0.9,-0.9; TP4 0,0.9; TP5 0,0; TP6 0,-0.9; TP7 0.9,0.9; TP8 0.9,0; TP9 0.9,-0.9
RWL(S-PQFP-N9)_LONG = smd 1.65 x 0.45: 1 -1.1,0.77 | smd 3.85 x 0.45: 2A 0,0.17 | smd 1.125 x 0.225: 2B 0,-0.092 | smd 1 x 0.25: 3 -1.35,-0.475; 8 1.35,-0.475 | smd 0.25 x 1: 4 -0.75,-1.35; 5 -0.25,-1.35; 6 0.25,-1.35; 7 0.75,-1.35 | smd 2 x 0.45: 9 0.925,0.77
DBV(R-PDSO-G5) = smd 1.1 x 0.6: 1 -1.3,0.95; 2 -1.3,0; 3 -1.3,-0.95; 4 1.3,-0.95; 5 1.3,0.95
ISP-M_TP = smd 1.8 x 1.8: 1 0,0; 2 2.54,0; 3 0,-2.54; 4 2.54,-2.54; 5 0,-5.08; 6 2.54,-5.08
M2X03R = drill 1.02 pad 1.778 square: 1 0,0 | drill 1.02 pad 1.778 octagon: 2 2.54,0; 3 0,-2.54; 4 2.54,-2.54; 5 0,-5.08; 6 2.54,-5.08
M2X02R = drill 1.02 pad 1.778 square: 1 0,0 | drill 1.02 pad 1.778 octagon: 2 2.54,0; 3 0,-2.54; 4 2.54,-2.54
M2X01L = drill 1.02 pad 1.778 square: 1 0,0 | drill 1.02 pad 1.778 octagon: 2 2.54,0
CSTNE = smd 0.4 x 1.9: 1 -1.2,0; 2 0,0; 3 1.2,0

### Placement (x,y rotation side)
C100  23.01,15.3 0 bottom
C101  26.11,16.2 0 bottom
C102  27.8,3.44 270 bottom
C103  26.4,3.44 270 bottom
C104  5.81,20.8 0 bottom
C120  36.81,6.2 270 bottom
C121  39.71,6.2 270 bottom
C140  54.01,7.7 90 bottom
C141  52.01,7.7 90 bottom
C210  48.5,21.11 90 bottom
C211  50,21.11 90 bottom
C212  63.8,20.71 180 bottom
C213  63.8,22.49 180 bottom
C300  20.01,8 180 top
C301  21.71,10.6 270 top
C302  16.6,6.21 270 top
C303  28.21,15.1 90 top
C304  24.21,14.5 270 top
C305  22.21,14.5 270 top
C311  8.71,12.5 180 bottom
C330  41.61,21.9 180 top
C331  41.71,19.9 180 top
C332  40.21,13 0 top
C333  36.81,11.3 90 top
C334  40.21,10.7 0 top
C340  45.61,0.9 0 top
C341  45.61,2.7 0 top
C342  47.11,9.8 180 top
C343  47.11,12.2 180 top
C344  50.41,11 270 top
C350  28.79,20.3 90 top
C351  21.79,19.4 180 top
D310  3.9,12 90 bottom
D320  8.79,15.4 180 bottom
D321  18.1,20.71 90 top
FB210  55.91,22.9 180 bottom
FB211  55.91,21.3 180 bottom
L300  18.81,12.5 90 top
L330  47.91,17.9 270 top
L340  39.41,4.8 90 top
LED300  14.61,3 180 top
LED301  12.8,3 270 top
PAD_BAT+  31.3,16.8 0 top
PAD_BAT-  31.3,19.8 0 top
PAD_IN+  8.81,5.4 0 top
PAD_IN-  8.81,2.6 270 top
Q310  7.89,9.6 180 bottom
Q320  5.01,17.6 90 bottom
R100  27.8,3.44 270 top
R101  18.99,11.4 45 bottom
R102  20.04,3.99 225 top
R103  22.04,3.73 225 top
R140  49.61,6.6 270 bottom
R200  17.71,16.3 270 bottom
R201  19.31,16.3 270 bottom
R210  48.92,17.39 90 bottom
R211  46.86,15 180 bottom
R300  11.11,4.9 90 bottom
R301  31.1,10.3 180 top
R302  31.1,8.7 180 top
R303  15.71,8.8 0 top
R304  14.9,6.21 90 top
R310  5.7,12.7 270 bottom
R320  8.8,18.19 0 bottom
R321  14.21,21.8 0 top
R322  15,3.8 315 bottom
R323  16.1,2.7 135 bottom
R330  39.11,20.4 270 top
R331  37.41,18.3 270 top
R332  37.41,21.2 270 top
R333  35.1,20.51 0 top
R334  35.1,21.99 0 top
R340  48.91,2.9 90 top
R341  50.61,6.5 90 top
R342  50.61,2.9 90 top
R350  21.69,21.6 0 top
R351  22.09,18.1 180 bottom
RT300  14.9,18.3 270 bottom
RT301  16.5,18.3 270 top
TP300  28.91,11.9 90 top
U100  26.11,10 270 bottom
U110  1.48,13.47 90 top
U120  38.01,9.5 180 bottom
U140  52.91,4.3 0 bottom
U200  8.9,25.3 0 top
U210  53.2,18.21 90 bottom
U300  25.61,9.5 90 top
U330  40.21,16.2 180 top
U340  47.11,6.5 0 top
U350  25.39,20.8 180 top
U$3  [HACKFFM_LOGO_STOP]  54.5,1 0 top
U$9  [DATE]  33,30.2 180 bottom
X100  30.6,1.2 180 bottom
X120  58.7,19.1 0 top
X140  58.7,10.97 0 top
X210  61.24,22.14 180 top
X320  8.9,21.09 0 top
X340  53.15,10.66 90 top
Y100  29.67,14.7 225 bottom

### Tracks (layer width: path | path; a pad name or v marks a point on that pad's centre or on a via)
+3V3  (via drill 0.3)
  Top 0.254: R102.2 19.47,3.39 19.47,3.25 v20.42,2.3 21.25,3.13 R103.2
  Top 0.61: v29.01,2.6 R100.2
  Bottom 0.254: U120.5 38.77,10.47 38.5,10.2 38.5,4.7 39.1,4.1 v39.41,4.1
  Bottom 0.305: U100.4 25.86,14.25 24.81,15.3 C100.1 | v26.51,17.2 26.51,16.7 C101.1 26.86,15.9 U100.6 | v34.71,8.5 34.73,8.53 U120.1 36.81,8.53 C120.1
  Bottom 0.61: R101.2 17.89,12.5 v17.19,12.5 | C100.1 23.91,15.35 v23.91,16.6
  other vias: 33.14,1.2 24.69,20.8 24.09,20.8 23.49,20.8 25.09,20.3 25.09,19.7 25.09,19.1 53.01,6.4
  pour Top (no thermals): 22.3,18.9 22.2,19 22.2,19.8 23.1,19.8 23.3,20 23.3,20.8 23.4,20.9 24.8,20.9 25.2,20.5 25.2,19.1 25,18.9
  pour Route15 (rank 5): 3.4,0.04 3.4,15.6 0,19 0,30.04 65.52,30.04 65.52,0.04
  pour Bottom (no thermals): 52.44,5.54 51.36,5.54 49.9,7 49.1,7 49.1,7.9 51,7.9 51.5,7.4 52.5,7.4 53.1,6.8 53.1,6.2
+5V1  (via drill 0.3)
  Top 0.254: R331.2 36.2,16.24
  other vias: 36.2,17.2 35,19 35,18.4 35.6,18.4 35,17.8 35.6,17.2 36.2,17.8 35.6,17.8 39.8,14.4 39.2,14.4 38.6,14.4 38.1,14.7 35.1,17.3 7.84,29.35 7.84,28.75 10.12,28.74 10.12,29.34 12.72,29.34 12.72,28.74
  pour Top (no thermals): 40.11,15.5 40.11,9.1 36.11,9.1 36.11,10.9 37.81,10.9 38.21,11.3 38.21,13.7 37.81,14.1 36.5,14.1 34.71,15.89 34.71,19 34.9,19.2 35.1,19.2 36.4,17.9 36.4,17 38.2,15.5
  pour Route15 (rank 3): 6.7,29.3 6.7,22.63 7.7,21.73 24.5,22 33.9,14.3 36.2,14.3 39.9,14.2 40.1,14.4 40.1,30.1 7.5,30.1
  pour Bottom: 34.9,19.05 52.07,19.05 52.07,18.4 50.8,18.4 48.4,16 41.8,16 40,14.2 37.9,14.2 34.9,17.2
  pour Bottom (no thermals): 49.8,17.4 47.9,17.4 47.9,20.9 50.8,20.9 50.8,19.8 51.6,19 52,19 52,18.4 50.8,18.4
  pour Top: 7.6,28.6 7.6,30.2 12.9,30.2 12.9,28.6
+5V5  (via drill 0.3)
  Bottom 0.254: C121.1 U120.8
  Bottom 0.61: C121.1 46.75,7.05 v48,8.3
  other vias: 51,13.4 55.1,7.4 55.1,6.8 55.7,7.4 55.1,8 55.7,8 50.4,13.4 49.8,13.4 49.2,13.4 48.6,13.4 47.4,8.3 48.6,8.3
  pour Top (no thermals): 47.17,7.18 47.17,13.6 51.21,13.6 51.21,11.4 49.41,11.4 48.71,10.7 48.71,9 49.71,8 51.11,8 51.11,7.18
  pour Route15: 54.3,6.1 65.2,6.1 65.2,18 59,18 55,14 49,14 47,12 47,7.4 48.3,6.2 51.8,6.2 52.7,7 53.3,7
  pour Bottom (no thermals): 53.6,5.56 53.6,7.4 54.4,7.4 54.9,7.9 54.9,8.1 55,8.2 55.8,8.2 55.9,8.1 55.9,7.3 54.16,5.56
AOUT1
  Bottom 0.254: U140.2 54.66,5.05 54.81,5.2
  Bottom 0.61: X140.1 57.3,9.57 57.3,7.7 54.81,5.2
AOUT2
  Bottom 0.254: U140.3 55.36,4.55 55.51,4.7
  Bottom 0.61: X140.3 58.7,7.89 55.51,4.7
AREF
  Bottom 0.254: U100.20 26.36,4.19 C103.1
BAT  (via drill 0.3)
  Top 0.254: R321.2 v16.1,21.8
  Route15 0.61: v16.1,21.8 24.9,21.8 28.2,18.5 28.7,18.5 30.1,17.1
  other vias: 32.2,15.7 30.2,17.7 31.2,15.3 31.8,15.3 29.9,17.2 32.2,14.9 44.4,22.2 43.9,22.2 46.3,22.5 43.5,21.9 45.1,22.5 45.7,22.5 42.9,4.4 42.3,4.4 41.7,4.4 41.1,4.4 42.9,3.8 42.3,3.8 41.7,3.8 41.1,3.8 43.5,22.5
  pour Top (rank 2, no thermals): 36.21,0 36.21,4.8 43.11,4.8 44.33,6.02 46.13,6.02 45.4,5.29 45.4,0
  pour Top (no thermals): 26.34,11.18 26.34,13.94 27.3,14.9 29.1,14.9 29.8,15.6 29.8,17.1 27.5,19.4 26.2,19.4 26.2,20 29.1,20 31.3,17.8 31.7,17.8 32.4,17.1 32.4,14.8 30.6,13 28,13 26.9,11.9 26.9,11.18
  pour Top (rank 2, no thermals): 51.11,22.7 51.11,17.9 44.21,17.9 42.99,16.68 41.19,16.68 41.92,17.41 41.92,22.7
  pour Route15 (rank 2, no thermals): 29.7,10.4 29.7,17.5 30.1,17.9 31.6,17.9 36.6,12.9 39.6,12.9 42.3,15.6 42.3,22.1 43.1,22.9 47,22.9 47.3,22.6 47.3,13 46.5,12.2 46.5,7 43.1,3.6 41.1,3.6 35.6,9.1 31,9.1
BCLK  (via drill 0.3)
  Top 0.254: 21.96,29.51 22.86,28.61 22.86,27.24 23.53,26.57 50.23,26.57 50.8,26 50.8,23.1 54.8,19.1 v54.8,16.8 | U200.12 U200.SMD_12
  Top 0.305: U200.SMD_12 21.96,29.51
  Bottom 0.305: v54.8,16.8 54.8,17.46 U210.16
BOUT1
  Bottom 0.254: U140.4 55.16,4.05 55.31,3.9
  Bottom 0.406: 59.97,9.1 59.97,7.76
  Bottom 0.61: 59.97,7.76 56.11,3.9 55.31,3.9 | 59.97,9.1 59.97,9.7 X140.2
BOUT2
  Bottom 0.254: U140.5 54.56,3.55 54.71,3.4
  Bottom 0.61: X140.4 61.24,7.83 56.51,3.1 55.01,3.1 54.71,3.4
BUTTON_SENSE
  Bottom 0.254: U100.22 25.36,5.56 24.5,4.7 22.9,4.7 21.6,3.4 16.93,3.4 R323.2 15.63,4.39 R322.1
CHARGER_!CE  (via drill 0.3)
  Top 0.254: U300.9 29.71,9.25 R302.2 31.1,9.54 31.1,10.9 31.4,11.2 32.5,11.2 32.8,10.9 32.8,10.6 v33,10.4
  Bottom 0.254: U100.12 32.85,10.25 v33,10.4
DIN  (via drill 0.3)
  Top 0.254: U200.SMD_40 56.86,29.21 v55.88,29.21
  Bottom 0.254: v55.88,29.21 54.01,29.21 53.34,28.54 53.34,24.86 53.9,24.3 55.3,24.3 55.9,23.7 55.9,19.8 56.7,19 56.7,17.1 55.7,16.1 53.95,16.1 U210.1
DTR
  Bottom 0.254: Q320.3 5.01,20.8 C104.2
EN_3V3
  Bottom 0.254: U100.32 21.45,11.75 20.9,12.3 20.9,18.1 R351.1
EN_3V3_BUTTON
  Top 0.254: R350.1 19.2,19.96 D321.1
EN_3V3_JMP  (via drill 0.3)
  Top 0.254: 26.95,21.75 U350.3 26.05,21.75 25.4,22.4 23.34,22.4 R350.2 22.7,21.6 v22.7,20.5
  Bottom 0.254: R351.2 22.7,18.1 v22.7,20.5
EN_5V1  (via drill 0.3)
  Top 0.254: R333.1 33.7,20.06 33.7,14.25 v32.7,13.25
  Bottom 0.254: U100.2 24.86,12.04 25.1,11.8 27.91,11.8 28.41,12.3 30.7,12.3 31.65,13.25 v32.7,13.25
EN_5V1_BUTTON  (via drill 0.3)
  Top 0.254: R334.1 34.16,22 v32.8,22 | v20.3,22.7 20.24,22.7 D321.2
  Bottom 0.254: v32.8,22 32.39,21.59 21.41,21.59 v20.3,22.7
EN_5V1_JMP
  Top 0.254: U330.7 39.46,19.25 39.06,19.65 R330.2 38.71,19.55 38.71,18.7 38.31,18.3 36.7,18.3 35.95,19.05 R333.2 R334.2
EN_5V5  (via drill 0.3)
  Top 0.254: v34,13.6 33.3,12.9 v33.3,11.25
  Bottom 0.254: U100.11 31.9,10.75 32.4,11.25 v33.3,11.25 | v34,13.6 35.1,12.5 52.45,12.5 X340.2
EN_5V5_JMP
  Top 0.254: U340.7 47.86,4.15 48.26,3.75 R340.2 49.31,3.75 49.31,5.9 49.91,6.5 51.5,6.5 52,7 52,9.51 X340.1
GAIN
  Bottom 0.254: U210.2 53.45,15.15 53.2,14.9 46.96,14.9 R211.COM
GND  (via drill 0.3)
  Top 0.254: U300.2 24.86,6.26 | 31.05,7.8 29.7,7.8 28.75,8.75 | RT300.P$1 15.32,19.15 RT301.1
  Top 0.305: U300.2 24.86,9.35 U300.TP4 | U300.8 26.45,8.75
  Top 0.61: U350.2 28.44,20.8
  Bottom 0.254: U100.21 25.86,5.36 25.36,4.86 v25.36,4.7 | Y100.2 30.4,15.43 30.4,15.71 v28.91,17.2 | 53.45,19.64 U210.11
  Bottom 0.305: U100.3 25.36,14.05 25.11,14.3 23.16,14.3 C100.2 | U100.5 26.36,14.84 25.61,15.59 25.61,16.2 | 25.61,16.2 v25.61,17.2 | C101.2 25.61,16.2 | C121.2 39.71,5.4 v41.81,5.4 | v35.81,5.6 36.56,5.6 C120.2 | U120.4 35.51,10.47 v35.51,11.2 | 53.55,17.96 U210.15 56.02,17.96 | 52.95,17.79 U210.3 52.95,15.48 | 53.45,18.54 53.45,19.64 53.45,20.44 v53.91,20.9
  Bottom 0.61: v45.31,14.2 45.31,14.7
  other vias: 40.21,20.9 40.81,20.9 41.31,18.4 40.61,18.5 39.71,22.3 39.21,22.3 40.91,14.4 41.41,14.4 41.91,14.4 42.31,14.1 42.31,13.6 42.91,10.5 42.31,10.5 37.41,13.5 36.81,13.5 36.21,13.5 50.01,0.7 51.51,0.7 48.01,0.7 49.01,0.7 47.51,0.7 48.51,0.7 49.51,0.7 46.41,8.3 45.81,8.3 45.21,8.3 44.61,8.3 45.01,10.7 45.01,11.3 45.51,11 49.81,8.8 50.41,8.8 51.01,8.8 17.91,8 6.41,14.7 6.91,14.7 28.29,22.2 21.49,20.4 28.11,17.2 27.31,17.2 21.71,16.6 44.91,8.8 51.01,0.7 40.91,18.9 17.91,7.4 17.91,8.6 22.41,16.6 23.51,12.4 22.91,12.4 22.31,12.4 21.71,12.4 18.51,6.8 19.11,6.8 33.14,6.28 25.41,2.3 27.81,1.1 13.75,5.6 28.89,22.2 29.79,20.6 27.69,22.2 30.69,22.2 41.41,20.9 38.41,22.7 40.41,22.9 38.71,22.3 27.71,17.6 28.51,17.6 7.61,1.9 8.01,1.5 9.51,1.4 9.91,1.8 10.01,3.3 9.61,3.7 8.01,3.7 7.61,3.3 55.91,17.7 52.81,15.5 57.01,16.5 20.99,20.4 20.49,20.4 30.09,22.2 31.19,22.2 29.49,22.2 29.79,20.1 9.91,14.2 9.91,14.7 9.91,13.7 46.08,4.2 50.51,0.7 52.91,2.2 52.31,2.2 53.51,2.2 53.01,8.7 41.41,18.9 46.68,4.2 46.08,3.7 46.68,3.7 10.91,19 2.31,19.8 10.01,11.25 13.35,6 12.95,6.4 52.31,15.5 54.61,20.2 55.91,17.2
  pour Top (no thermals): 40.61,9.1 40.61,15.5 41.91,15.5 43.11,14.3 43.11,9.1
  pour Top (no thermals): 46.71,13.6 46.71,7.18 45.37,7.18 44.21,8.32 44.21,13.6
  pour GND: 0,30.04 65.52,30.04 65.52,0.04 3.4,0.04 3.4,15.6 0,19
  pour Top (no thermals): 21.5,14.1 24.88,14.1 24.88,9.9 24.36,9.9 24.36,11.7 23.86,12.2 21.7,12.2 21.5,12.4
  pour Top (no thermals): 19.6,8.8 17.9,8.8 17.7,8.6 17.7,7.4 18.5,6.6 19.1,6.6 19.6,7.1
  pour Top (no thermals): 27.6,21.9 27.6,20.6 27.7,20.5 29.3,20.5 31,18.8 31.8,18.8 32.3,19.3 32.3,20.3 30.2,22.4 28.1,22.4
  pour Top (no thermals): 21.7,20.4 21.5,20.6 20.4,20.6 20.2,20.4 20.2,19 20.4,18.8 21.5,18.8 21.7,19
  pour Top (no thermals): 36.1,11.7 36.1,13.6 37.5,13.6 37.5,11.7
  pour Top (no thermals): 51.1,10.6 51.1,8.7 49.7,8.7 49.7,10.6
  pour Top (no thermals): 51.1,2.4 47.7,2.4 46.86,3.24 46.86,5.52 46.24,5.52 45.9,5.2 45.9,0.2 46.4,-0.3 50.5,-0.3 51.1,0.3
  pour Top (no thermals): 36.9,22 37.9,22 38.6,21.3 38.6,20.8 39.7,20.8 40.44,20.06 40.44,17.18 41.06,17.18 41.4,17.5 41.4,22.7 41.2,22.9 36.9,22.9
  pour Bottom (no thermals): 52.6,5 52.6,3 51.9,2.3 51.9,-0.1 52.1,-0.3 54.2,-0.3 54.4,-0.1 54.4,2.9 54.3,3 53.6,3 53.2,3.4 53.2,5
  pour Top (rank 5): 0,31.31 65.6,31.31 65.6,0.04 3.4,0.04 3.4,15.6 0,19
  pour Bottom (rank 5): 0,31.31 65.52,31.31 65.52,0.04 3.4,0.04 3.4,15.6 0,19
  pour Route15 (rank 4): 65.5,30.5 65.5,9 38,9 38,30.5
INPUT
  pour Bottom (no thermals): 3.4,9.3 3.4,6.8 5.9,4.3 9.9,4.3 9.9,7 9.2,7.7 7,7.7 6.6,8.1 6.6,10.1 4.2,10.1
LRCLK  (via drill 0.3)
  Top 0.254: v56.1,18.7 56.1,19.6 U200.SMD_35 U200.35
  Bottom 0.254: v56.1,18.7 55.86,18.46 U210.14
MISO  (via drill 0.3)
  Top 0.254: v32.7,7.6 31.87,6.77 31.87,2.17 X100.1
  Bottom 0.254: U100.16 32.05,8.25 v32.7,7.6
  other vias: 30.6,1.2
MOSI/MOT_AENBL
  Bottom 0.254: U140.9 48.56,4.05 47.01,2.5 38,2.5 35.05,5.45 | U100.15 33.35,8.75 35.05,7.05 35.05,5.45 | X100.4 33.34,3.74 35.05,5.45
MOT_APHASE
  Bottom 0.254: U140.10 48.36,4.55 46.91,3.1 39.11,3.1 37.81,4.4 37.81,11.2 37.11,11.9 32,11.9 31.35,11.25 U100.10
MOT_BENBL
  Bottom 0.254: U100.1 24.36,11.65 24.71,11.3 27.01,11.3 27.41,10.9 27.41,8.7 28.61,7.5 31.4,7.5 31.87,7.03 31.87,3.03 32.43,2.47 33.7,2.47 35.27,0.9 46.81,0.9 48.96,3.05 U140.7
MOT_BPHASE  (via drill 0.3)
  Top 0.254: v34.61,3.77 34.01,4.37 v34.01,12.6
  Bottom 0.254: U140.8 48.76,3.55 47.21,2 36.38,2 v34.61,3.77
  Bottom 0.305: v34.01,12.6 31.81,12.6 30.96,11.75 U100.9
N$1
  Top 0.2: U330.2A U330.2B
  Top 0.406: 47.91,15.63 L330.2 47.91,16.03 U330.2A
  pour Top (no thermals): 51.11,16.4 51.1,17.3 43.41,17.3 42.21,16.1 42.21,15.9 43.41,14.7 51.11,14.7
N$2  (via drill 0.3)
  Top 0.254: v8.79,19.11 9.46,19.11 X320.2 11.73,20.8 17,20.8 D321.3
  Bottom 0.254: D320.3 v8.79,19.11
N$3
  Top 0.2: U340.2A U340.2B
  Top 0.406: U340.2A 39.41,6.67 L340.2
  pour Top (no thermals): 36.21,5.5 44,5.5 45,6.5 45.11,6.6 45.11,6.8 43.91,8 36.21,8
N$4
  Top 0.254: U340.6 47.36,3.45 47.91,2.9 49.76,2.9 R342.2 R341.1
N$5
  Top 0.254: U330.6 39.96,20.15 39.71,20.4 37.56,20.4 R332.2 R331.1
N$6
  Bottom 0.305: U210.10 52.95,20.8
  Bottom 0.61: FB211.1 55.06,21.7 53.6,21.7 52.95,21.05 52.95,20.8
N$7
  Bottom 0.305: 52.45,20.4 U210.9 52.3,19.68 52.3,19.6
  Bottom 0.61: FB210.1 53.5,22.9 52.1,21.5 52.1,19.6 52.3,19.6
N$8
  Bottom 0.254: Y100.3 29.77,13.1 U100.8
N$9
  Bottom 0.254: Y100.1 27.36,14.09 U100.7
N$10
  Top 0.254: U300.12 28.71,11.71 TP300.TP
N$11  (via drill 0.3)
  Top 0.254: U300.11 28.65,10.25 32.7,14.3 v32.9,14.3 | R304.2 14.9,8.76 R303.1 14.86,16.28 RT300.P$2 15.32,17.45 RT301.2 16.75,17.2 23,17.2 v23.2,17
  Bottom 0.254: v23.2,17 23.4,17.2 23.8,17.2 24.9,18.3 32.1,18.3 32.8,17.6 32.8,14.4 v32.9,14.3
N$12
  Top 0.254: U300.22 17.01,9.25 R303.2 16.56,7.1 C302.1
N$13
  Top 0.254: R301.2 29.71,9.75 U300.10
N$14
  Top 0.254: U300.21 21.71,9.75 C301.2
N$15
  Bottom 0.254: D320.2 10.62,15.62 10.62,7.88 13.9,4.6 13.9,3.7 R322.2
N$15_SW
  pour Top (no thermals): 17,10.7 17,11.7 23.4,11.7 23.94,11.16 23.94,10.24 22.64,10.24 22.2,10.7
N$16
  Bottom 0.254: D310.A 4.62,10.57 Q310.4 6.34,11.85 R310.2
N$17
  pour Top (no thermals): 20.3,7.3 20.3,8.6 20.5,8.8 23.9,8.8 23.9,8.7 22.8,8.7 22.4,8.3 22.4,7.8 21.9,7.3
N$18
  Bottom 0.254: R320.2 7.95,16.6 D320.1 Q320.1
N$19  (via drill 0.3)
  Top 0.254: LED301.K 13.32,2.25 LED300.C | U300.4 25.86,6.06 24,4.2 v24,3.6
  Bottom 0.254: v24,3.6 20.9,0.5 14.03,0.5 LED301.K
N$20
  Top 0.254: LED301.A 13.32,3.75 LED300.A
  Bottom 0.254: R300.1 11.49,4.27 LED301.A
N$22
  Top 0.254: X320.1 10.11,22.3 12.86,22.3 R321.1
N$24
  Bottom 0.254: U140.11 50.31,5.05 R140.2
N$25  (via drill 0.3)
  Top 0.254: v27.6,5.4 27.8,5.2 R100.1
  Bottom 0.254: U100.18 27.36,5.64 v27.6,5.4 27.8,5.2 R100.1
N$26
  Top 0.254: U200.SMD_8 U200.8
  Bottom 0.254: U200.8 17.79,26.57 17.79,17.49 17.4,17.1 17.4,17.15 R200.1
N$27
  Top 0.254: U200.SMD_10 U200.10
  Bottom 0.254: U200.10 20.33,26.57 20.33,23.95 18.9,22.52 18.9,17.15 R201.1
NRF_!CS
  Bottom 0.254: U100.24 24.36,6.06 24,5.7 22.5,5.7 21.2,4.4 17.6,4.4 14.6,7.4 14.6,10.9 12.66,12.84 U110.4
NRF_CS
  Bottom 0.254: U100.23 24.86,5.66 24.4,5.2 22.7,5.2 21.4,3.9 17.3,3.9 14.1,7.1 14.1,10.4 12.94,11.56 U110.3
NRF_MISO
  Bottom 0.254: U100.26 22.15,8.75 21.9,8.5 21.9,6.5 20.8,5.4 18.2,5.4 15.6,8 15.6,13.9 12.86,16.64 U110.7
NRF_SCK
  Bottom 0.254: U100.25 22.85,8.25 22.4,7.8 22.4,6.3 21,4.9 17.9,4.9 15.1,7.7 15.1,11.9 12.89,14.11 U110.5
RASPI_DTR  (via drill 0.3)
  Top 0.254: U200.15 U200.SMD_15 26.08,23.63 v25.41,24.3
  Bottom 0.254: Q320.2 3.9,16.6 3.9,19.3 0.5,22.7 0.5,28.3 2.2,30 24.76,30 25.41,29.35 v25.41,24.3
RASPI_RX
  Bottom 0.254: U100.31 21.35,11.25 19.31,13.29 R201.2
RASPI_TX
  Bottom 0.254: U100.30 21.15,10.75 17.71,14.19 R200.2
RESET  (via drill 0.3)
  Top 0.254: X100.5 30.6,2.9 29.4,1.7 19.86,1.7 18.32,3.14 18.32,3.74 19,4.42 v19,6
  Bottom 0.254: U100.29 20.14,10.25 R101.1 17,10.8 | v19,6 18.3,6 17,7.3 17,10.8 | 17,10.8 16.3,11.5 16.3,13.9 13.6,16.6 13.6,18.2 12,19.8 7.66,19.8 C104.1
  other vias: 30.6,6.28
SCK/NRF_MOSI  (via drill 0.3)
  Top 0.254: U110.6 12.62,15.38 13.5,14.5 13.5,7.51 v13.2,7.21
  Bottom 0.254: 30.6,3.9 X100.3 | 30.56,3.4 X100.3 | 28.7,3.44 25.76,3.44 24.9,4.2 23,4.2 21.7,2.9 19.4,2.9 18.6,2.1 16.7,2.1 14.36,4.45 14.36,6.05 v13.2,7.21 | U100.17 27.86,6.14 28.7,5.3 28.7,3.44 | 28.7,3.44 29.34,3.44 29.64,3.74 X100.3
SCL  (via drill 0.3)
  Top 0.254: U300.5 26.36,4.76 24.6,3 23.4,3 22.58,3.82 | 22.58,3.82 20.4,6 v20.4,6.3 | R103.1 22.64,3.88 22.58,3.82
  Bottom 0.254: U100.28 21.35,9.75 20.4,8.8 v20.4,6.3
SD_MODE
  Bottom 0.254: U210.4 52.45,16.2 48.92,16.2 R210.1
SDA  (via drill 0.3)
  Top 0.254: v21.2,6.7 21,6.9 20.1,6.9 19.8,6.6 19.8,6 20.64,5.16 | 20.64,5.16 23.3,2.5 24.7,2.5 26.86,4.66 U300.6 | R102.1 20.64,5.16
  Bottom 0.254: U100.27 21.85,9.25 21.2,8.6 v21.2,6.7
SERVO1
  Bottom 0.254: U100.14 35.36,9.25 35.44,9.18 U120.2
SERVO1_5V5
  Bottom 0.254: U120.7 40.58,9.18 40.8,9.4 54.4,9.4 55,10 55,12 57.02,14.02 X120.5
SERVO2
  Bottom 0.254: U100.13 35.36,9.75 35.44,9.82 U120.3
SERVO2_5V5
  Bottom 0.254: U120.6 48.62,9.82 50.8,12 53.8,12 57.1,15.3 59.96,15.3 X120.6
SYS
  pour Top (no thermals): 17,13.2 17,15.2 17.8,16 25.4,16 25.88,15.52 25.88,11.18 25.34,11.18 25.36,14.24 25,14.6 21.1,14.6 20.7,14.2 20.7,13.2
VBUS  (via drill 0.3)
  Bottom 0.254: 4.7,12.7 D310.C 7.96,12.7 7.96,12.5 C311.1 | 8.26,10 8.26,9.6 | 7.92,10.1 Q310.TP3 | R300.2 11.11,6.55 Q310.TP2
  Bottom 1.27: 8.26,9.6 Q310.TP0 Q310.TP4 | C311.1 7.92,12.36 7.92,10.1
  other vias: 23.7,7.6 23.7,7 23.7,6.4 23.1,7.6 23.1,7 23.1,6.4
  pour Top (no thermals): 24.3,7.8 23.1,7.8 22.9,7.6 22.9,6.4 23.1,6.2 24.1,6.2 24.3,6.4
  pour Route15: 9.5,10.9 8.1,10.9 7.5,10.3 7.5,6.93 11.97,2.46 21.73,2.46 24.2,5.2 24.2,7.8 21.8,10.2 15.2,10.2 13.5,8.5 10.5,8.5 10.2,8.8 10.2,10.2
VO+
  Bottom 0.61: C213.1 62.6,22.14 X210.1 59.88,23.5 58,23.5 57.4,22.9 FB210.2
VO-
  Bottom 0.61: C212.1 60.13,20.71 X210.2 57.86,21.3 FB211.2

### Text on the board
bPlace: Spkr
tStop: 1 | SPK | GND | - | 5V5 | + | PPM | M1 | FPV-Auto | V1.0 | M2 | + | -
bStop: hackffm.de/fpva | Pin1 | BTN | NTC | Lutz Lisseck / David Merges | + | -